# EasyEDA Pro project RAM.eprj

# Schematic Schematic1
Board Name: Board1; Create Date: 2025-08-20; Page Name: P1; Project Name: RAM; Schematic Name: Schematic1; Update Date: 2025-08-20; Company: EasyEDA.com; Page Size: A4; Version: V1.0
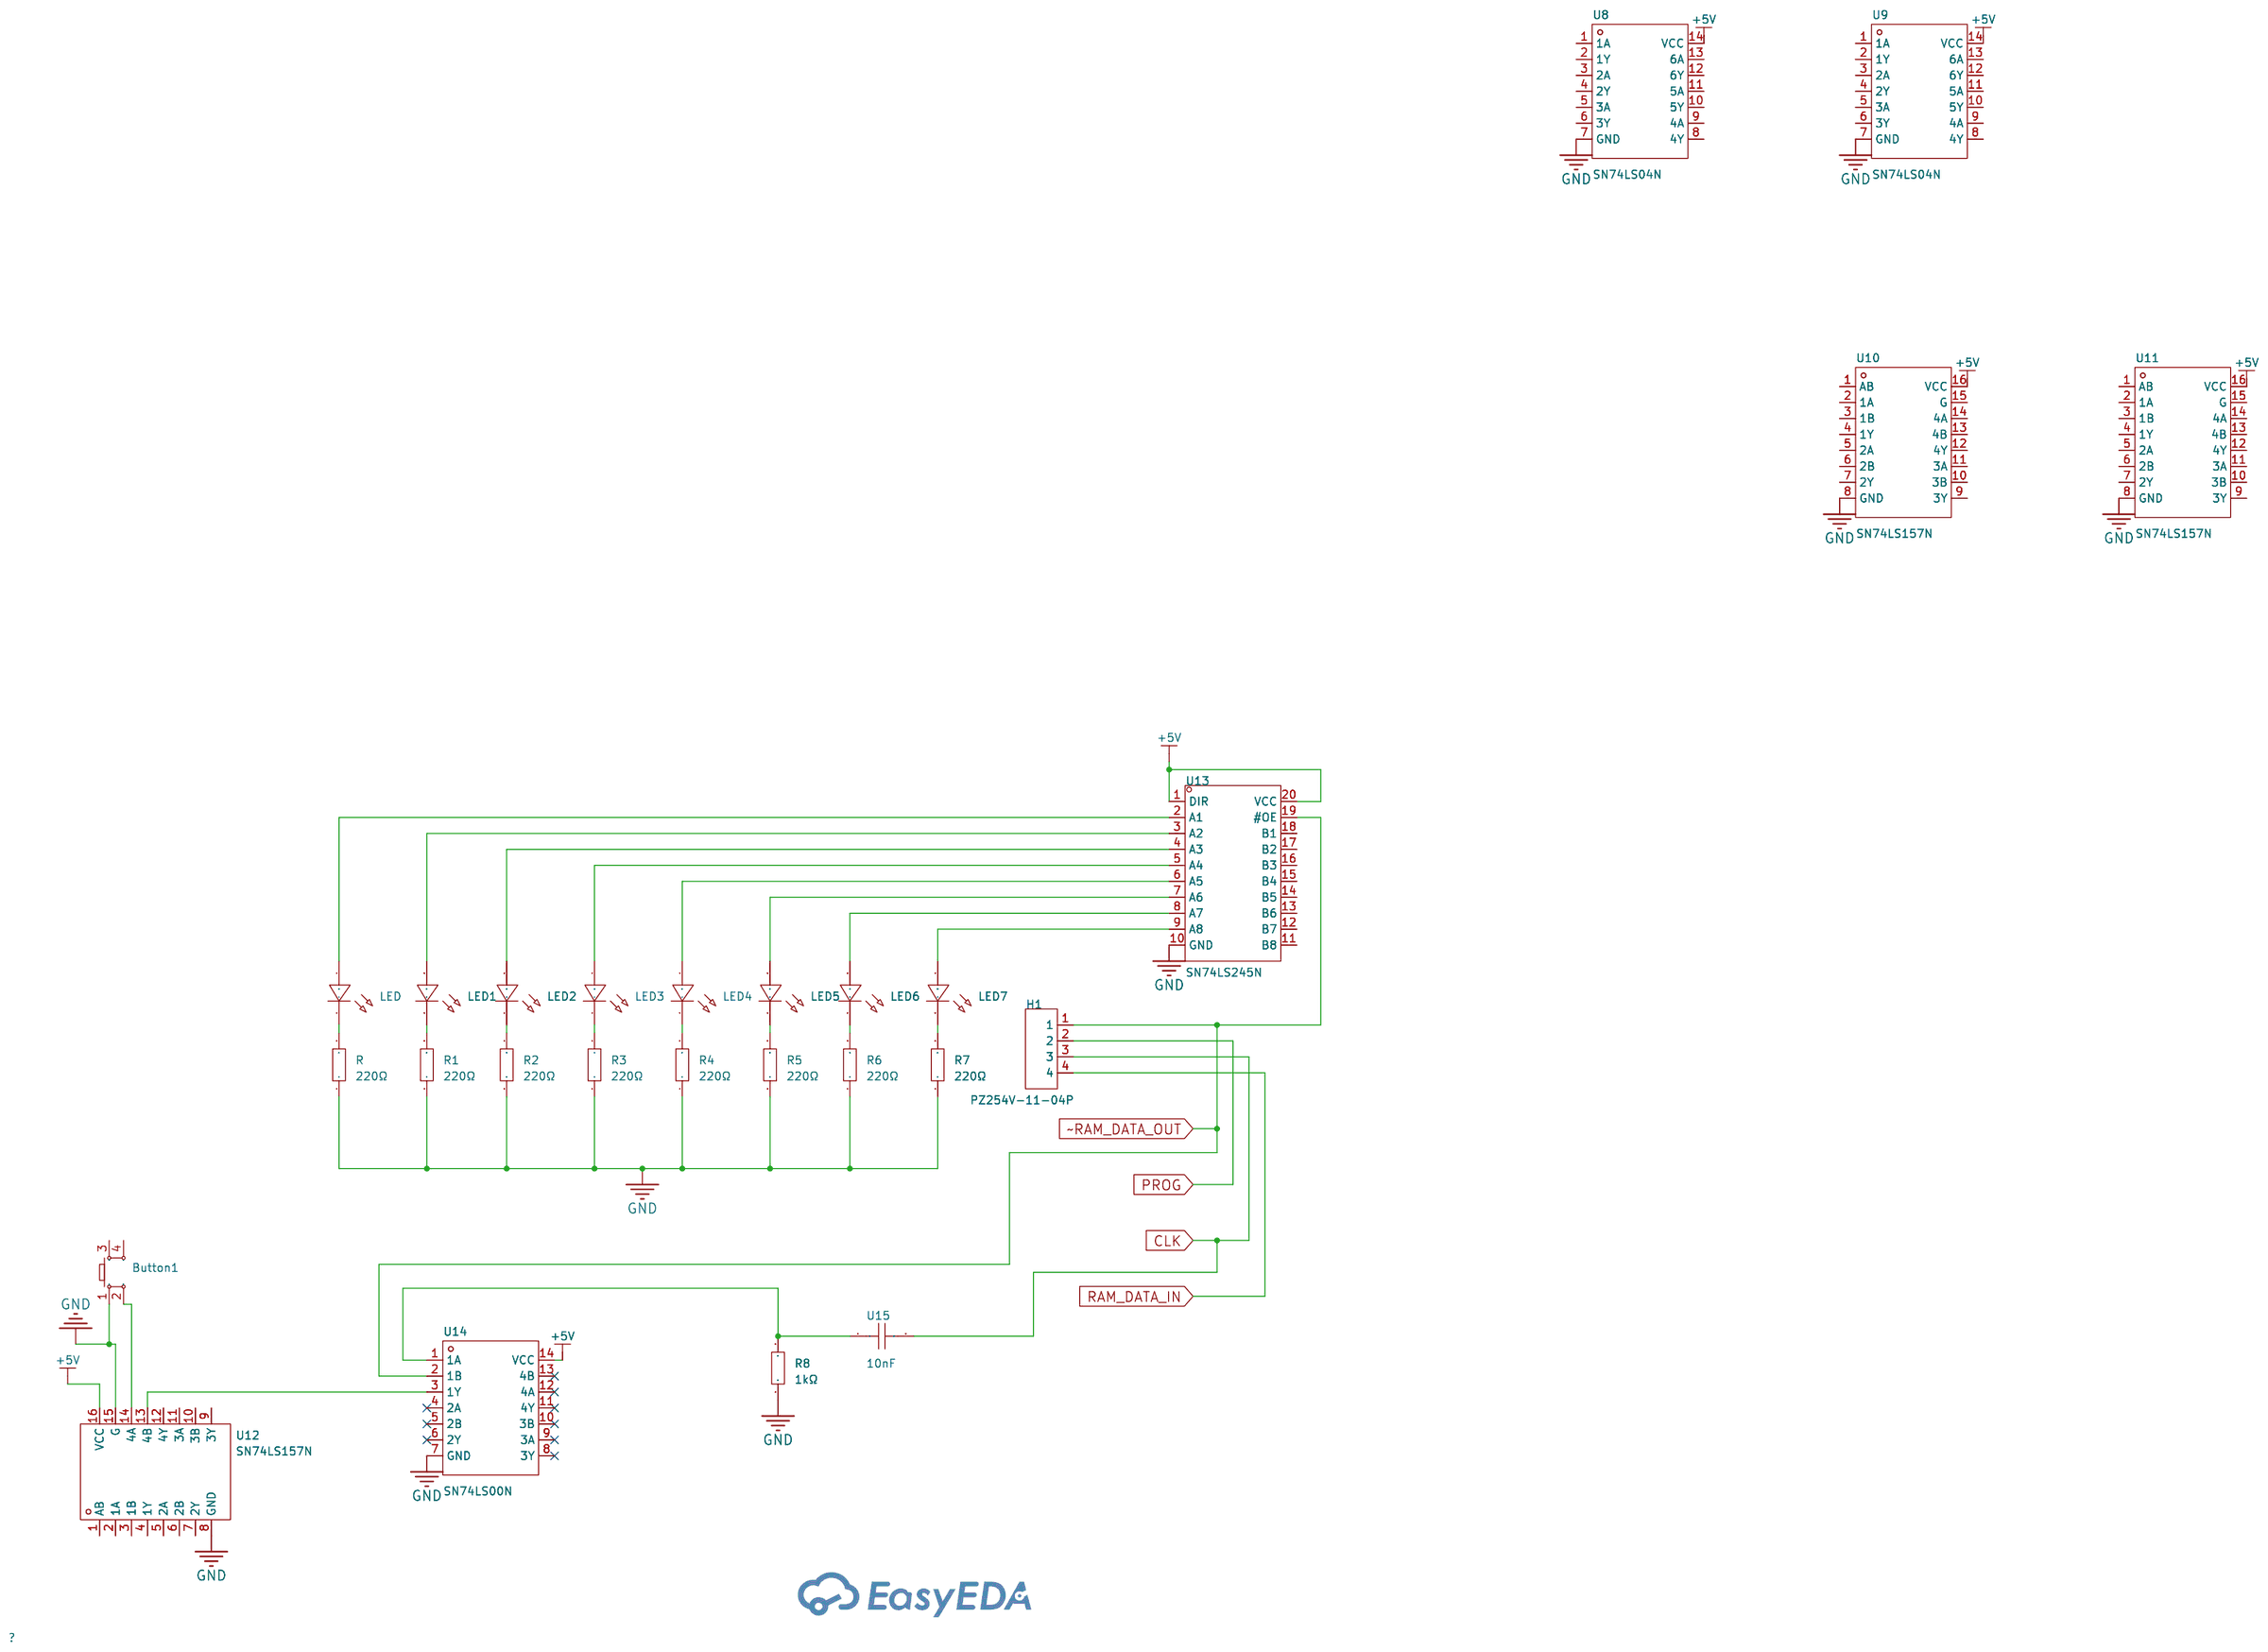
[diagram p0: schematic sheet]

## Parts
Button1  -  [SW-TH_4P-L6.0-W6.0-P4.50-LS6.5]
H1  PZ254V-11-04P  [HDR-TH_4P-P2.54-V-M]
LED  -  [LED-TH_BD5.8-P2.54-FD]
LED1  -  [LED-TH_BD5.8-P2.54-FD]
LED2  -  [LED-TH_BD5.8-P2.54-FD]
LED3  -  [LED-TH_BD5.8-P2.54-FD]
LED4  -  [LED-TH_BD5.8-P2.54-FD]
LED5  -  [LED-TH_BD5.8-P2.54-FD]
LED6  -  [LED-TH_BD5.8-P2.54-FD]
LED7  -  [LED-TH_BD5.8-P2.54-FD]
R  220Ω  [R_AXIAL-0.4]
R1  220Ω  [R_AXIAL-0.4]
R2  220Ω  [R_AXIAL-0.4]
R3  220Ω  [R_AXIAL-0.4]
R4  220Ω  [R_AXIAL-0.4]
R5  220Ω  [R_AXIAL-0.4]
R6  220Ω  [R_AXIAL-0.4]
R7  220Ω  [R_AXIAL-0.4]
R8  1kΩ  [R_AXIAL-0.4]
U8  SN74LS04N  [PDIP-14_L19.7-W6.6-P2.54-LS8.3-BL]
U9  SN74LS04N  [PDIP-14_L19.7-W6.6-P2.54-LS8.3-BL]
U10  SN74LS157N  [DIP-16_16P-L20.2-W6.6-P2.54-LS7.6-BL]
U11  SN74LS157N  [DIP-16_16P-L20.2-W6.6-P2.54-LS7.6-BL]
U12  SN74LS157N  [DIP-16_16P-L20.2-W6.6-P2.54-LS7.6-BL]
U13  SN74LS245N  [DIP-20_L25.5-W10.0-P2.54-LS7.6-BL]
U14  SN74LS00N  [PDIP-14_L19.7-W6.6-P2.54-LS8.3-BL]
U15  10nF  [CAP-TH_L5.8-W3.6-P5.0-D0.6]

## Library data of the parts
Button1 = Key_TH_6x6x6: Supplier Footprint: Through
H1 = PZ254V-11-04P_C492403: LCSC Part Name: 1x4P 间距:2.54mm 方针 直插; Supplier Part: C492403; Manufacturer: XFCN(兴飞); Supplier Footprint: 插件,P=2.54mm; JLCPCB Part Class: Extended Part; Datasheet: https://atta.szlcsc.com/upload/public/pdf/source/20200309/C492403_F9F19131791D08044AD4F84F8E751A34.pdf; Supplier: LCSC; Pin Structure: 1x4P; Pitch: 2.54mm; Circluar Pins/Square Pins: Policy; Mounting Type: Straight; Number of Rows: Single Row; Number of Pins: 4P; Length of Mating Pin: 6mm; Insulation Height: 2.5mm; Length of End Connection Pin: 3mm; Contact Material: Brass; Operating Temperature: -40℃~+105℃; Color: Black
LED LED1-LED7 = LED_TH-R_5mm: Supplier Footprint: Through
R R1-R8 = Res_AXIAL-1/4W: Supplier Footprint: Through
U8 U9 = SN74LS04N: Supplier Part: C183657; Manufacturer: TI(德州仪器); Supplier Footprint: PDIP-14; JLCPCB Part Class: Extended Part; Datasheet: https://www.ti.com/cn/lit/gpn/sn74ls04; Supplier: LCSC; Voltage - Supply: 4.75V~5.25V; Number of Circuits: 6; Number of Inputs: 1; Current - Output Low(IOL): 8mA; Current - Output High(IOH): 400uA; Input Logic Level - High: 2V; Input Logic Level -Low: 800mV; Max Propagation Delay: 15ns@5V,15pF; Series: 74LSSeries; Operating Temperature: 0℃~+70℃
U10-U12 = SN74LS157N: Supplier Part: C139317; Manufacturer: TI(德州仪器); Supplier Footprint: DIP-16; JLCPCB Part Class: Extended Part; Datasheet: https://www.ti.com/cn/lit/gpn/sn74ls157; Supplier: LCSC; Type: Multiplexers; Voltage Supply Source: Single supply; Supply Voltage: 4.75V~5.25V; Sink Current: 8mA; Source Current: 400uA; Operating temperature: 0℃~+70℃
U13 = SN74LS245N: Supplier Part: C352966; Manufacturer: TI(德州仪器); Supplier Footprint: DIP-20; JLCPCB Part Class: Extended Part; Datasheet: https://www.ti.com/cn/lit/gpn/sn74ls245; Supplier: LCSC; output type: Tri-State; Voltage - Supply: 4.75V~5.25V; Number of Elements: 1; Number of Bits per Element: 8; Current - Output Low(IOL): 24mA; Current - Output High(IOH): 15mA; Logic Family: 74LS; Operating Temperature: 0℃~+70℃
U14 = SN74LS00N: Supplier Part: C181629; Manufacturer: TI(德州仪器); Supplier Footprint: PDIP-14; JLCPCB Part Class: Extended Part; Datasheet: https://www.ti.com/cn/lit/gpn/sn74ls00; Supplier: LCSC; Logic Type: NAND Gate; Number of Channels: 4; Voltage - Supply: 4.75V~5.25V; Current - Output Low(IOL): 8mA; Current - Output High(IOH): 400uA; Input Logic Level - High: 2V; Input Logic Level - Low: 800mV; Series: 74LSSeries; Propagation Delay: 15ns@5V,15pF; Operating Temperature: 0℃~+70℃
U15 = 178MU0008: LCSC Part Name: 10nF ±10% 50V; Supplier Part: C5632432; Manufacturer: KNSCHA(科尼盛); Supplier Footprint: 插件,P=5.08mm; JLCPCB Part Class: Extended Part; Datasheet: https://atta.szlcsc.com/upload/public/pdf/source/20230506/8CBF6601BC3A02D4AEF1B8CBEE08BA14.pdf; Supplier: LCSC; Tolerance: ±10%; Voltage Rating: 50V; Temperature Coefficient: X7R

## Nets
+5V: U8.14(VCC) U9.14(VCC) U10.16(VCC) U11.16(VCC) U12.16(VCC) U13.1(DIR) U13.20(VCC) U14.14(VCC)
GND: Button1.1 R.1 R1.1 R2.1 R3.1 R4.1 R5.1 R6.1 R7.1 R8.1 U8.7(GND) U9.7(GND) U10.8(GND) U11.8(GND) U12.8(GND) U12.15(G) U13.10(GND) U14.7(GND)
CLK: H1.3 U15.2
PROG: H1.2
RAM_DATA_IN: H1.4
~RAM_DATA_OUT: H1.1 U13.19(#OE) U14.2(1B)
Net-(Button1-2): Button1.2 U12.14(4A)
Net-(LED1-1): LED1.1(C) U13.3(A2)
Net-(LED1-2): LED1.2(A) R1.2
Net-(LED2-1): LED2.1(C) U13.4(A3)
Net-(LED2-2): LED2.2(A) R2.2
Net-(LED3-1): LED3.1(C) U13.5(A4)
Net-(LED3-2): LED3.2(A) R3.2
Net-(LED4-1): LED4.1(C) U13.6(A5)
Net-(LED4-2): LED4.2(A) R4.2
Net-(LED5-1): LED5.1(C) U13.7(A6)
Net-(LED5-2): LED5.2(A) R5.2
Net-(LED6-1): LED6.1(C) U13.8(A7)
Net-(LED6-2): LED6.2(A) R6.2
Net-(LED7-1): LED7.1(C) U13.9(A8)
Net-(LED7-2): LED7.2(A) R7.2
Net-(LED-1): LED.1(C) U13.2(A1)
Net-(LED-2): LED.2(A) R.2
Net-(R8-2): R8.2 U14.1(1A) U15.1
Net-(U12-13): U12.13(4B) U14.3(1Y)

Not connected (* = marked no-connect by the designer): Button1 3 4; U8 1(1A) 2(1Y) 3(2A) 4(2Y) 5(3A) 6(3Y) 8(4Y) 9(4A) 10(5Y) 11(5A) 12(6Y) 13(6A); U9 1(1A) 2(1Y) 3(2A) 4(2Y) 5(3A) 6(3Y) 8(4Y) 9(4A) 10(5Y) 11(5A) 12(6Y) 13(6A); U10 1(AB) 2(1A) 3(1B) 4(1Y) 5(2A) 6(2B) 7(2Y) 9(3Y) 10(3B) 11(3A) 12(4Y) 13(4B) 14(4A) 15(G); U11 1(AB) 2(1A) 3(1B) 4(1Y) 5(2A) 6(2B) 7(2Y) 9(3Y) 10(3B) 11(3A) 12(4Y) 13(4B) 14(4A) 15(G); U12 1(AB) 2(1A) 3(1B) 4(1Y) 5(2A) 6(2B) 7(2Y) 9(3Y) 10(3B) 11(3A) 12(4Y); U13 11(B8) 12(B7) 13(B6) 14(B5) 15(B4) 16(B3) 17(B2) 18(B1); U14 4(2A)* 5(2B)* 6(2Y)* 8(3Y)* 9(3A)* 10(3B)* 11(4Y)* 12(4A)* 13(4B)*
